# EAGLE design NealEL2MOCOPTOS (EAGLE 7.1.0)
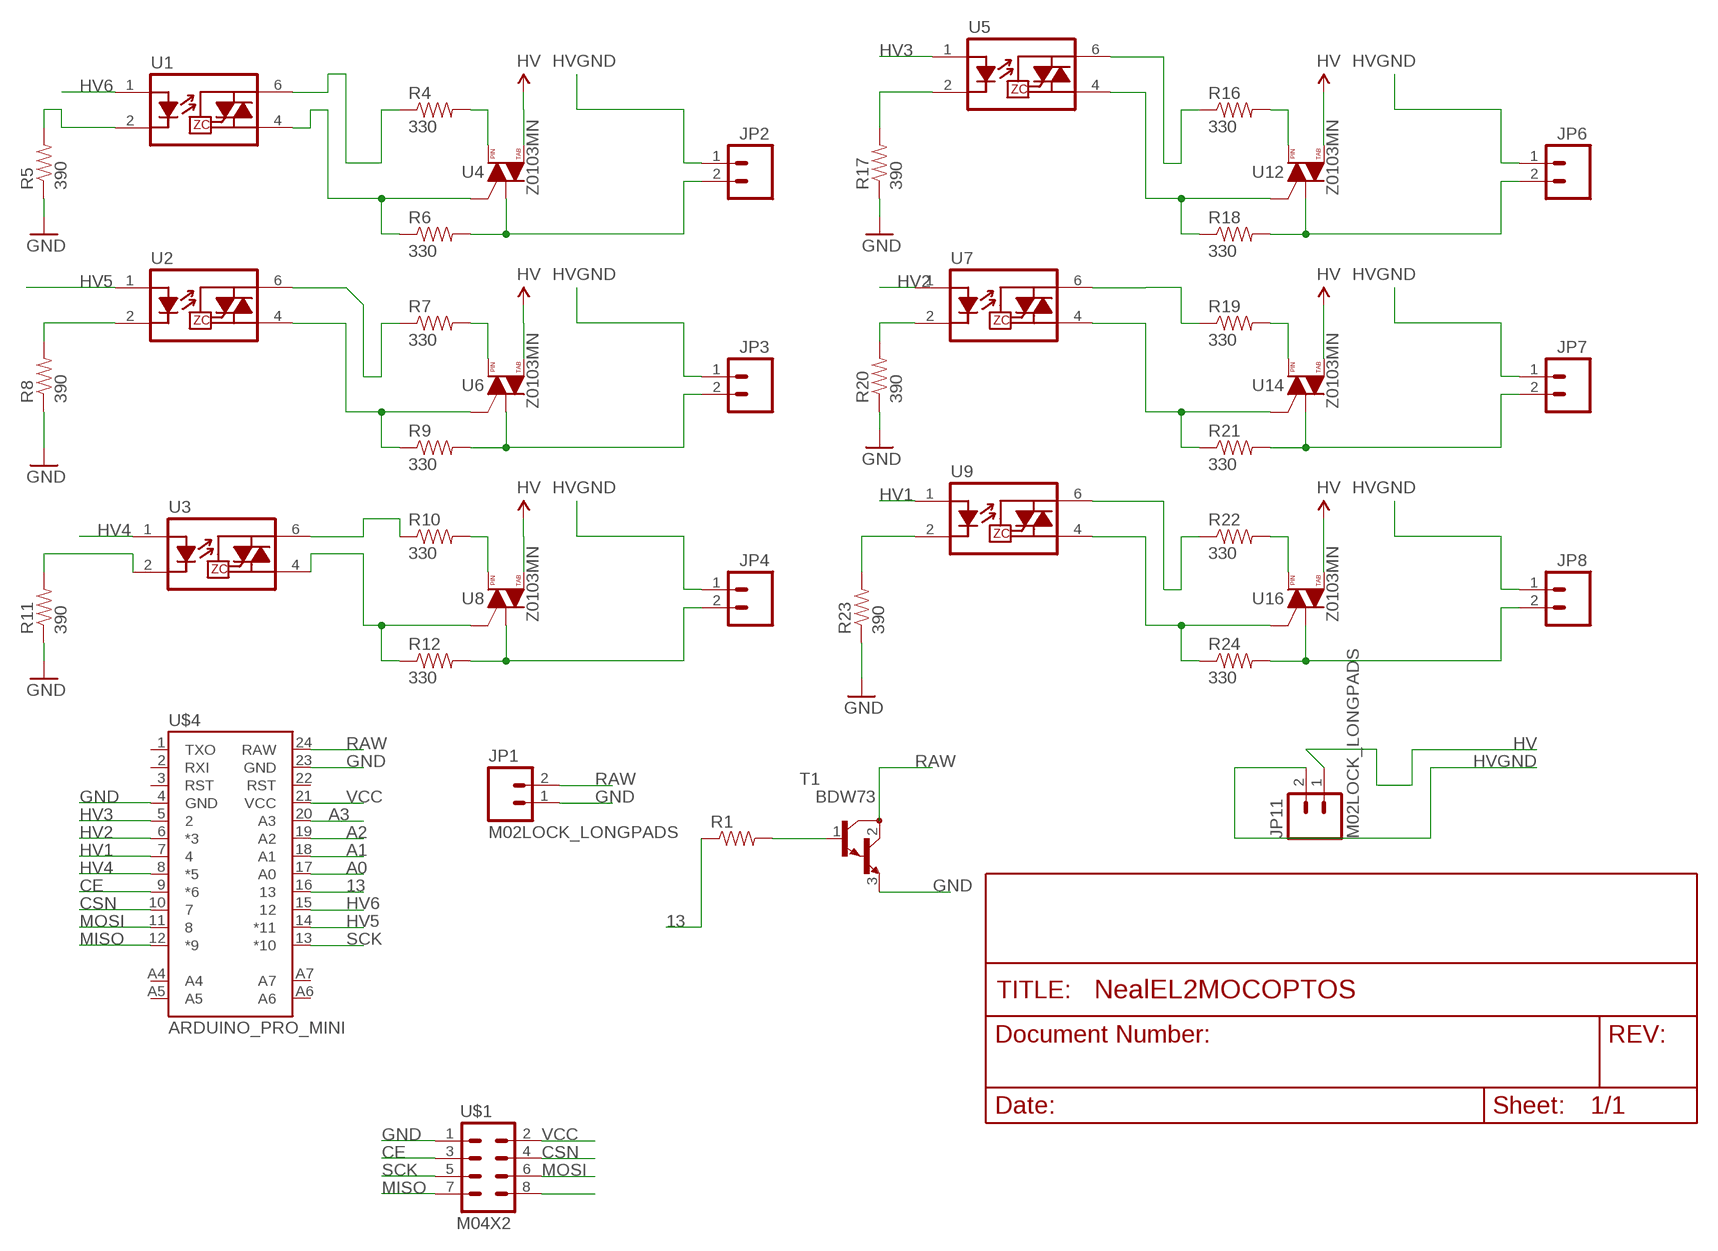
[diagram p0: schematic, sheet 1]

## Parts
JP1  M02LOCK_LONGPADS  [1X02_LOCK_LONGPADS]
JP2  M02PTH  [1X02]
JP3  M02PTH  [1X02]
JP4  M02PTH  [1X02]
JP6  M02PTH  [1X02]
JP7  M02PTH  [1X02]
JP8  M02PTH  [1X02]
JP11  M02LOCK_LONGPADS  [1X02_LOCK_LONGPADS]
R1  RESISTORPTH-1/2W  [AXIAL-0.5]
R4  330  RESISTOR0603-RES  [0603-RES]
R5  390  RESISTOR0603-RES  [0603-RES]
R6  330  RESISTOR0603-RES  [0603-RES]
R7  330  RESISTOR0603-RES  [0603-RES]
R8  390  RESISTOR0603-RES  [0603-RES]
R9  330  RESISTOR0603-RES  [0603-RES]
R10  330  RESISTOR0603-RES  [0603-RES]
R11  390  RESISTOR0603-RES  [0603-RES]
R12  330  RESISTOR0603-RES  [0603-RES]
R16  330  RESISTOR0603-RES  [0603-RES]
R17  390  RESISTOR0603-RES  [0603-RES]
R18  330  RESISTOR0603-RES  [0603-RES]
R19  330  RESISTOR0603-RES  [0603-RES]
R20  390  RESISTOR0603-RES  [0603-RES]
R21  330  RESISTOR0603-RES  [0603-RES]
R22  330  RESISTOR0603-RES  [0603-RES]
R23  390  RESISTOR0603-RES  [0603-RES]
R24  330  RESISTOR0603-RES  [0603-RES]
T1  BDW73  [TO220]
U1  MOC3063S  [DIP8SMD]
U2  MOC3063S  [DIP8SMD]
U3  MOC3063S  [DIP8SMD]
U4  Z0103MN  TRIACSMD  [SOT223]
U5  MOC3063S  [DIP8SMD]
U6  Z0103MN  TRIACSMD  [SOT223]
U7  MOC3063S  [DIP8SMD]
U8  Z0103MN  TRIACSMD  [SOT223]
U9  MOC3063S  [DIP8SMD]
U12  Z0103MN  TRIACSMD  [SOT223]
U14  Z0103MN  TRIACSMD  [SOT223]
U16  Z0103MN  TRIACSMD  [SOT223]
U$1  M04X2  [2X4]
U$4  ARDUINO_PRO_MINI  [ARDUINO_PRO_MINI]

## Nets
13: R1.P$1 U$4.16
A0: U$4.17(A0)
A1: U$4.18(A1)
A2: U$4.19(A2)
A3: U$4.20(A3)
CE: U$1.3 U$4.9(*6)
CSN: U$1.4 U$4.10
GND: JP1.1 R5.1 R8.1 R11.1 R17.1 R20.1 R23.1 T1.3(E) U$1.1 U$4.4(GND) U$4.23(GND)
HV: JP11.1 U4.4(T2) U6.4(T2) U8.4(T2) U12.4(T2) U14.4(T2) U16.4(T2)
HV1: U9.1(A) U$4.7
HV2: U7.1(A) U$4.6(*3)
HV3: U5.1(A) U$4.5
HV4: U3.1(A) U$4.8(*5)
HV5: U2.1(A) U$4.14(*11)
HV6: U1.1(A) U$4.15
HVGND: JP2.1 JP3.1 JP4.1 JP6.1 JP7.1 JP8.1 JP11.2
MISO: U$1.7 U$4.12(*9)
MOSI: U$1.6 U$4.11
N$1: R1.P$2 T1.1(B)
N$5: R6.1 U1.4(T2) U4.3(G)
N$6: R8.2 U2.2(K)
N$7: R4.1 U1.6(T1)
N$8: JP2.2 R6.2 U4.1(T1)
N$9: R10.1 U3.6(T1)
N$10: R9.1 U2.4(T2) U6.3(G)
N$12: R7.1 U2.6(T1)
N$13: JP3.2 R9.2 U6.1(T1)
N$14: R5.2 U1.2(K)
N$15: R4.2 U4.2(T2)
N$16: R12.1 U3.4(T2) U8.3(G)
N$19: JP4.2 R12.2 U8.1(T1)
N$20: R7.2 U6.2(T2)
N$23: R17.2 U5.2(K)
N$24: R20.2 U7.2(K)
N$25: R23.2 U9.2(K)
N$26: R10.2 U8.2(T2)
N$27: R18.1 U5.4(T2) U12.3(G)
N$29: R16.1 U5.6(T1)
N$30: JP6.2 R18.2 U12.1(T1)
N$31: U$1.8
N$32: R21.1 U7.4(T2) U14.3(G)
N$34: R19.1 U7.6(T1)
N$35: JP7.2 R21.2 U14.1(T1)
N$36: R16.2 U12.2(T2)
N$37: R24.1 U9.4(T2) U16.3(G)
N$39: R22.1 U9.6(T1)
N$40: JP8.2 R24.2 U16.1(T1)
N$41: R19.2 U14.2(T2)
N$42: R22.2 U16.2(T2)
N$43: R11.2 U3.2(K)
RAW: JP1.2 T1.2(C) U$4.24(RAW)
SCK: U$1.5 U$4.13(*10)
VCC: U$1.2 U$4.21(VCC)
Unconnected: U$4.1(TXO) U$4.2(RXI) U$4.3(RST) U$4.22(RST) U$4.A4 U$4.A5 U$4.A6 U$4.A7

## Library data of the parts
JP1 JP11 = SparkFun-Connectors:M02: Standard 2-pin 0.1" header. Use with - straight break away headers ( PRT-00116) - right angle break away headers (PRT-00553) - swiss pins (PRT-00743) - machine pins (PRT-00117) - female headers (PRT-00115) Molex polarized connector foot print use with: PRT-08233 with associated crimp pins and housings. 2.54_SCREWTERM for use with PRT-10571. 3.5mm Screw Terminal footprints for PRT-08084 5mm Screw Terminal footprints for use with PRT-08432
JP2-JP4 JP6-JP8 = SparkFun:M02: Header 2 Standard 2-pin 0.1" header. Use with straight break away headers (SKU : PRT-00116), right angle break away headers (PRT-00553), swiss pins (PRT-00743), machine pins (PRT-00117), and female headers (PRT-00115). Molex polarized connector foot print use with SKU : PRT-08233 with associated crimp pins and housings.
R1 = SparkFun-Resistors:RESISTOR: Resistor Basic schematic elements and footprints for 0603, 1206, and PTH resistors.
R4-R12 R16-R24 = SparkFun:RESISTOR: Resistor Basic schematic elements and footprints for 0603, 1206, and PTH resistors.
T1 = transistor:BDW73: NPN BIPOLAR DARLINGTON TRANSISTOR
U1-U3 U5 U7 U9 = SparkFun-DiscreteSemi:MOC3063*: Optotriac in DIP and SMD LED: Vf: 1.2V If: 5 mA TRIAC Vdrm: 600V Itsm: 1A Viso: 5000V DV/dt: 1500V/us DIP: MOC3063 SMD: MOC3063S
U4 U6 U8 U12 U14 U16 = mike-temp:TRIAC
U$1 = SparkFun-Connectors:M04X2: .1" header, two rows of four.
U$4 = SparkFun-Boards:ARDUINO_PRO_MINI

## Net classes
0 Default: width 0.203 mm
1 VCC: width 0.305 mm
2 GND: width 0.813 mm
3 HV: width 0.381 mm

## Board
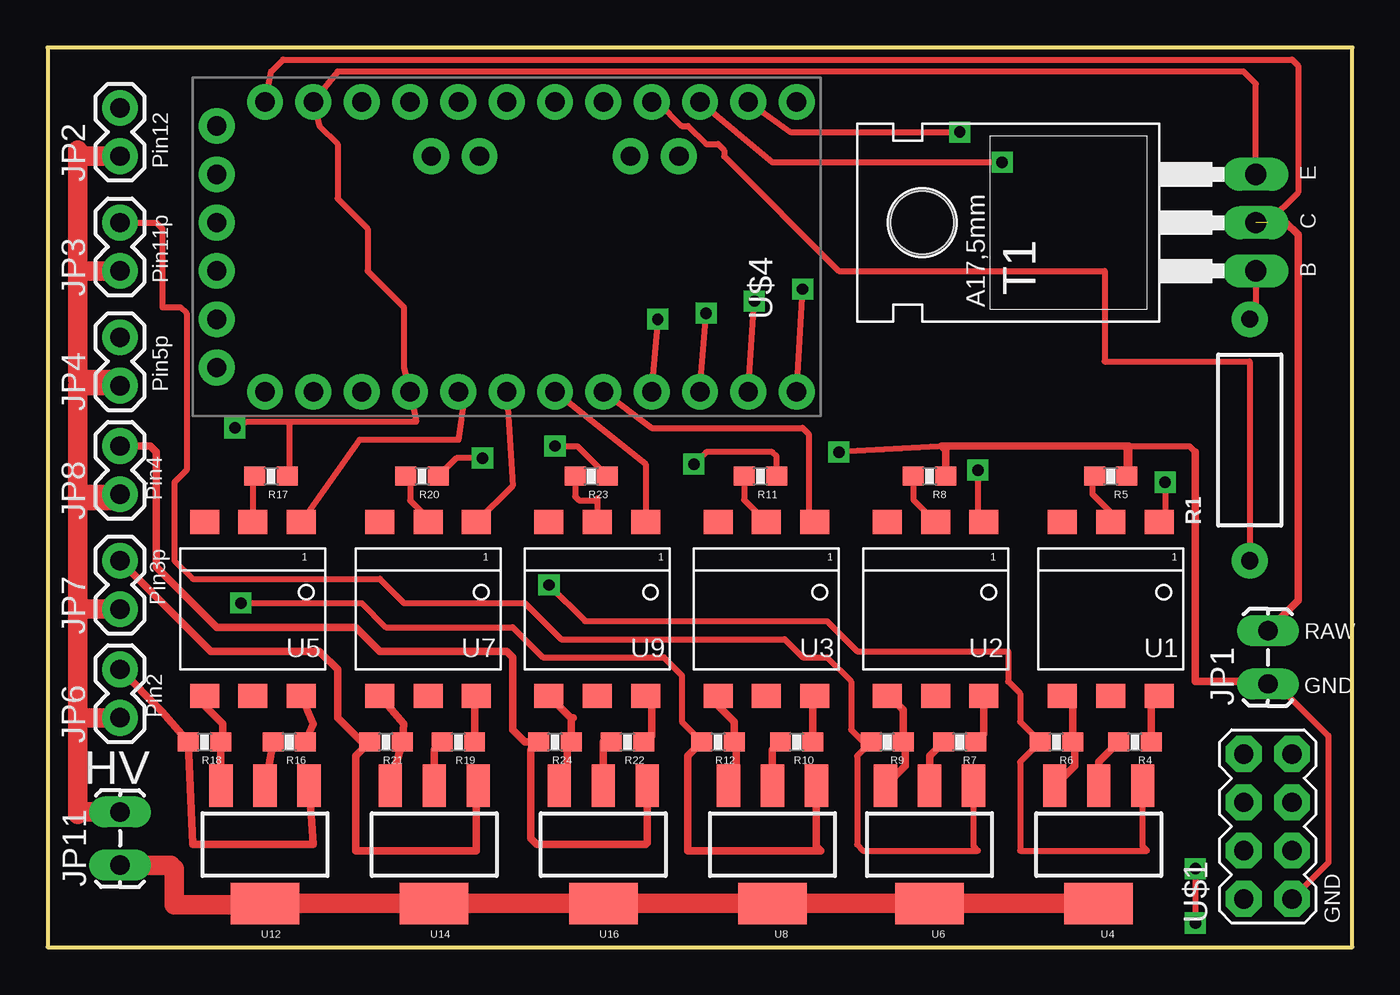
[diagram p1: board, top side]
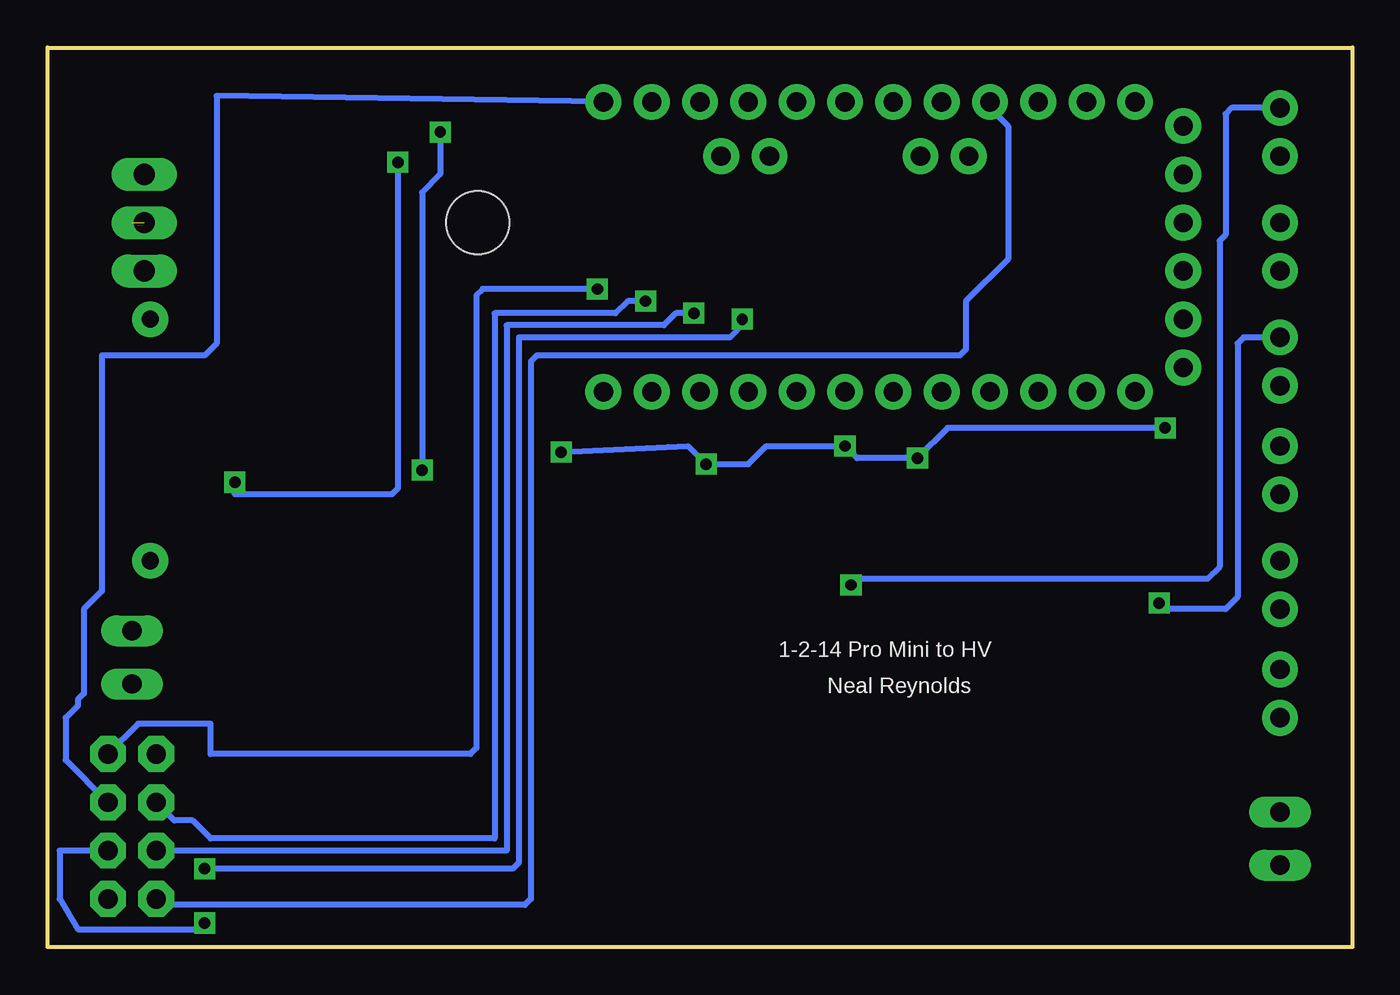
[diagram p2: board, bottom side, seen from below]

Size 68.58 x 47.31 mm. Coordinates in mm from the lower left corner, seen from the top.
Outline: 0,47.31 0,0 68.58,0 68.58,47.31 0,47.31
Copper layers (1*16): Top 0.035mm / dielectric 1.5mm / Bottom 0.035mm
Design rules "SparkFun": minimum track width 8mil, minimum drill 20mil, track to track 8mil, track to pad 8mil, pad to pad 8mil, via to via 8mil, smd to smd 8mil, copper to edge 8mil, drill to drill 8mil, minimum pad ring 12mil, minimum via ring 10mil, stop-mask expansion 4mil, vias tented up to drill 20mil, thermal gap 10mil

### Footprints (pad centres in the part's own frame; a part is rotated, then mirrored left to right if it is on the bottom)
1X02_LOCK_LONGPADS = drill 1.016 long: 1 -0.127,0; 2 2.667,0
1X02 = drill 1.016 pad 1.88: 1 0,0; 2 2.54,0
AXIAL-0.5 = drill 0.9 pad 1.88: P$1 -6.35,0; P$2 6.35,0
0603-RES = smd 1.1 x 1: 1 -0.85,0; 2 0.85,0
TO220 = drill 1.118 long: 1 -2.54,-6.35; 2 0,-6.35; 3 2.54,-6.35 | hole 3.302: 0,11.176
DIP8SMD = smd 1.524 x 1.27: 1 -2.54,-4.572; 2 0,-4.572; 3 2.54,-4.572; 4 2.54,4.572; 5 0,4.572; 6 -2.54,4.572
SOT223 = smd 1.219 x 2.235: 1 -2.311,-3.099; 2 0,-3.099; 3 2.311,-3.099 | smd 3.6 x 2.2: 4 0,3.099
2X4 = drill 1.016 pad 1.88 octagon: 1 -3.81,-1.27; 2 -3.81,1.27; 3 -1.27,-1.27; 4 -1.27,1.27; 5 1.27,-1.27; 6 1.27,1.27; 7 3.81,-1.27; 8 3.81,1.27
ARDUINO_PRO_MINI = drill 1.016 pad 1.88: 1 -7.62,12.7; 2 -7.62,10.16; 3 -7.62,7.62; 4 -7.62,5.08; 5 -7.62,2.54; 6 -7.62,0; 7 -7.62,-2.54; 8 -7.62,-5.08; 9 -7.62,-7.62; 10 -7.62,-10.16; 11 -7.62,-12.7; 12 -7.62,-15.24; 13 7.62,-15.24; 14 7.62,-12.7; 15 7.62,-10.16; 16 7.62,-7.62; 17 7.62,-5.08; 18 7.62,-2.54; 19 7.62,0; 20 7.62,2.54; 21 7.62,5.08; 22 7.62,7.62; 23 7.62,10.16; 24 7.62,12.7; A4 4.763,1.429; A5 4.763,3.969; A6 4.763,-9.049; A7 4.763,-6.509; BLK -6.35,15.24; GND -3.81,15.24; GRN 6.35,15.24; RXI 1.27,15.24; TXO 3.81,15.24; VCC -1.27,15.24

### Placement (x,y rotation side)
JP1  64.13,13.97 90 top
JP2  3.81,41.59 90 top
JP3  3.81,35.56 90 top
JP4  3.81,29.53 90 top
JP6  3.81,12.06 90 top
JP7  3.81,17.78 90 top
JP8  3.81,23.81 90 top
JP11  3.81,4.45 90 top
R1  63.18,26.67 90 top
R4  57.15,10.79 180 top
R5  55.88,24.77 180 top
R6  53.02,10.79 180 top
R7  47.94,10.79 180 top
R8  46.36,24.77 180 top
R9  44.13,10.79 180 top
R10  39.37,10.79 180 top
R11  37.47,24.77 180 top
R12  35.24,10.79 180 top
R16  12.7,10.79 180 top
R17  11.75,24.77 180 top
R18  8.26,10.79 180 top
R19  21.59,10.79 180 top
R20  19.68,24.77 180 top
R21  17.78,10.79 180 top
R22  30.48,10.79 180 top
R23  28.57,24.77 180 top
R24  26.67,10.79 180 top
T1  57.15,38.1 90 top
U1  55.88,17.78 180 top
U2  46.67,17.78 180 top
U3  37.78,17.78 180 top
U4  55.25,5.4 180 top
U5  10.79,17.78 180 top
U6  46.36,5.4 180 top
U7  20,17.78 180 top
U8  38.1,5.4 180 top
U9  28.89,17.78 180 top
U12  11.43,5.4 180 top
U14  20.32,5.4 180 top
U16  29.21,5.4 180 top
U$1  64.13,6.35 90 top
U$4  24.13,36.83 90 top

### Tracks (layer width: path | path; a pad name or v marks a point on that pad's centre or on a via)
13
  Top 0.305: R1.P$1 63.18,30.8 55.56,30.8 55.56,35.56 41.59,35.56 35.56,41.59 35.56,41.91 35.24,42.23 34.61,42.23 33.66,43.18 33.34,43.18 32.07,44.45 U$4.16
CE  (via drill 0.6)
  Top 0.305: U$4.9 32.07,32.7 v32.07,33.02 | v60.33,4.13 v60.33,1.27
  Bottom 0.305: v32.07,33.02 32.07,32.7 32.7,32.07 43.82,32.07 43.82,4.45 44.13,4.13 v60.33,4.13 | U$1.3 67.94,5.08 67.94,2.54 66.99,0.95 60.64,0.95 v60.33,1.27
CSN  (via drill 0.6)
  Top 0.305: U$4.10 v34.61,33.34
  Bottom 0.305: v34.61,33.34 35.56,33.34 36.2,32.7 44.45,32.7 44.45,5.08 U$1.4
GND  (via drill 0.6)
  Top 0.305: 12.7,27.62 19.37,27.62 U$4.4 18.73,30.48 18.73,33.65 16.83,35.56 16.83,37.78 15.24,39.37 15.24,42.23 14.29,43.18 U$4.23 15.24,46.04 62.87,46.04 63.5,45.4 T1.3 | 12.7,27.62 12.7,24.87 R17.1 | 12.7,27.62 10.48,27.62 v9.84,27.3 | v22.86,25.72 21.49,25.72 R20.1 | v26.67,26.35 27.84,26.35 R23.1 | R11.1 38.32,25.82 38.1,26.03 34.61,26.03 v33.97,25.4 | R8.1 47.21,26.25 47.31,26.35 v41.59,26.03 | JP1.1 64.58,13.84 67.31,11.11 67.31,4.45 U$1.1 | R5.1 56.73,26.25 56.83,26.35 60.01,26.35 60.33,26.03
  Top 0.406: 60.33,26.03 60.33,13.97 64.01,13.97 JP1.1 | R8.1 47.21,26.14 46.99,26.35 56.83,26.35 56.83,24.87 R5.1
  Bottom 0.305: v9.84,27.3 21.27,27.3 v22.86,25.72 26.04,25.72 v26.67,26.35 30.8,26.35 31.75,25.4 v33.97,25.4 34.93,26.35 v41.59,26.03
HV
  Top 1.016: JP11.1 6.48,4.32 6.67,4.13 6.67,2.22 11.35,2.22 U12.4 U14.4 U16.4 U8.4 | U8.4 38.66,2.3 38.73,2.22 38.18,2.22 U8.4 | U8.4 U6.4 U4.4
  Top 1.27: 11,2.73 U12.4
HV1
  Top 0.305: U$4.7 31.43,25.4 U9.1
HV2
  Top 0.305: U$4.6 24.45,24.26 U7.1
HV3
  Top 0.305: U$4.5 21.91,28.89 21.59,26.67 16.38,26.67 U5.1
HV4
  Top 0.305: U$4.8 31.75,27.3 39.69,27.3 40.01,26.99 40.01,22.67 U3.1
HV5  (via drill 0.6)
  Top 0.305: U$4.14 39.05,42.86 v47.94,42.86 | v48.9,25.08 48.9,22.67 U2.1
  Bottom 0.305: v47.94,42.86 47.94,40.64 48.9,39.69 v48.9,25.08
HV6  (via drill 0.6)
  Top 0.305: U$4.15 38.1,41.28 v50.16,41.28 | v58.74,24.45 58.74,22.67 U1.1
  Bottom 0.305: v50.16,41.28 50.16,24.13 50.48,23.81 58.74,23.81 v58.74,24.45
HVGND
  Top 1.016: JP11.2 1.71,7.11 1.59,6.99 1.59,12.07 | JP6.1 1.59,12.07 | 1.59,12.07 1.59,17.78 | JP7.1 1.59,17.78 | 1.59,17.78 1.59,23.49 | 1.59,23.49 1.59,23.81 | 1.59,23.81 JP8.1 3.49,23.49 1.59,23.49 | 1.59,23.81 1.59,29.53 JP4.1 3.49,29.85 1.59,29.85 1.59,35.56 | JP3.1 1.59,35.56 | 1.59,35.56 1.59,41.91 1.91,41.59 JP2.1
MISO  (via drill 0.6)
  Top 0.305: U$4.12 v39.69,34.61
  Bottom 0.305: v39.69,34.61 45.72,34.61 46.04,34.29 46.04,10.48 46.36,10.16 60.01,10.16 60.01,11.75 63.82,11.75 U$1.7
MOSI  (via drill 0.6)
  Top 0.305: U$4.11 v37.15,33.97
  Bottom 0.305: v37.15,33.97 38.1,33.97 38.73,33.34 45.09,33.34 45.09,5.71 60.01,5.71 60.96,6.67 61.91,6.67 U$1.6
N$1
  Top 0.305: T1.1 63.5,33.34 R1.P$2
N$5
  Top 0.406: U1.4 53.87,12.68 R6.1 53.98,10.69 53.98,9.52 52.95,8.5 U4.3
N$6
  Top 0.305: R8.2 45.51,23.52 U2.2
N$7
  Top 0.406: U1.6 58,12.79 R4.1
N$8  (via drill 0.6)
  Top 0.305: U4.1 57.56,5.31 57.79,5.08 51.12,5.08 51.12,9.74 R6.2 51.12,11.85 51.12,13.33 50.48,13.97 50.48,15.56 42.55,15.56 40.96,17.14 28.26,17.14 v26.35,19.05
  Top 0.406: U4.1 57.79,8.57
  Bottom 0.305: JP2.2 6.35,44.13 6.67,43.82 6.67,37.46 6.99,37.15 6.99,20 7.62,19.37 26.04,19.37 v26.35,19.05
N$9
  Top 0.406: U3.6 40.22,13.11 R10.1
N$10
  Top 0.406: U6.3 44.06,8.5 45.09,9.52 45.09,10.69 R9.1 44.98,12.49 44.45,13.02 44.32,13.02 U2.4
N$12
  Top 0.406: R7.1 49.21,11.22 U2.6
N$13
  Top 0.305: JP3.2 5.71,38.1 6.03,37.78 6.03,33.65 6.99,33.65 7.3,33.34 7.3,25.08 6.67,24.45 6.67,20.32 7.62,19.37 17.46,19.37 18.73,18.1 25.08,18.1 26.99,16.19 38.73,16.19 39.69,15.24 40.96,15.24 42.23,13.97 42.23,11.43 42.86,10.8 R9.2 42.55,10.06 42.55,5.4 42.86,5.08 48.9,5.08 48.67,5.31 U6.1
N$14
  Top 0.305: U1.2 55.88,22.86 54.93,23.81 54.93,24.66 R5.2
N$15
  Top 0.406: R4.2 55.25,9.74 U4.2
N$16
  Top 0.406: U8.3 35.79,8.8 36.2,9.21 36.2,10.69 R12.1 36.09,11.85 35.24,12.7 U3.4
N$19  (via drill 0.6)
  Top 0.305: v10.16,18.1 16.51,18.1 17.78,16.83 24.45,16.83 26.04,15.24 32.39,15.24 33.34,14.29 33.34,11.85 R12.2
  Top 0.406: U8.1 40.41,5.31 40.64,5.08 33.66,5.08 33.66,10.06 R12.2
  Bottom 0.305: JP4.2 5.71,32.07 6.03,31.75 6.03,18.42 6.67,17.78 9.84,17.78 v10.16,18.1
N$20
  Top 0.406: R7.2 46.36,10.06 U6.2
N$23
  Top 0.305: R17.2 10.79,24.66 U5.2
N$24
  Top 0.305: R20.2 19.05,24.55 19.05,23.49 20,22.54 U7.2
N$25
  Top 0.305: 28.89,23.6 28.89,23.49 | 28.89,23.49 U9.2 | R23.2 27.72,23.71 27.94,23.49 28.89,23.49
N$26
  Top 0.406: R10.2 38.1,10.38 U8.2
N$27
  Top 0.406: U12.3 9.11,8.51 R18.1 9.21,10.9 9.21,11.75 8.26,12.7 U5.4
N$29
  Top 0.406: U5.6 13.97,11.75 R16.1
N$30
  Top 0.406: JP6.2 6.03,12.38 R18.2 7.62,5.4 13.97,5.4 U12.1
N$32
  Top 0.406: U7.4 18.73,11.75 R21.1 U14.3
N$34
  Top 0.406: U7.6 22.44,13.11 R19.1
N$35
  Top 0.406: R21.2 16.56,10.43 | 16.56,10.43 16.19,10.06 16.19,5.08 22.54,5.08 22.54,7.94 22.63,8.03 U14.1 | JP7.2 8.57,15.56 14.29,15.56 15.24,14.6 15.24,12.07 16.56,10.74 16.56,10.43
N$36
  Top 0.406: R16.2 U12.2
N$37
  Top 0.406: U16.3 27.06,8.5 27.3,8.25 27.3,10.58 R24.1 27.52,11.96 27.62,12.07 27.5,12.07 U9.4
N$39
  Top 0.406: U9.6 31.75,12.89 31.75,11.11 31.43,10.8 R22.1
N$40
  Top 0.406: JP8.2 5.4,26.35 5.71,26.03 5.71,20 8.89,16.83 16.19,16.83 17.46,15.56 24.13,15.56 24.45,15.24 24.45,11.43 25.08,10.8 R24.2 25.4,10.38 25.4,5.71 25.72,5.4 31.43,5.4 31.52,5.49 U16.1
N$41
  Top 0.406: R19.2 20.32,10.38 U14.2
N$42
  Top 0.406: U16.2 29.21,10.8 R22.2
N$43
  Top 0.305: R11.2 36.62,23.52 U3.2
RAW  (1 unrouted)
  Top 0.305: U$4.24 11.75,46.04 12.38,46.67 65.41,46.67 65.72,46.35 65.72,39.69 64.13,38.1 64.13,37.78
  Top 0.406: T1.2 65.09,38.1 65.72,37.46 65.72,18.22 JP1.2
SCK
  Bottom 0.305: U$4.13 59.69,44.77 59.69,31.75 60.33,31.12 65.72,31.12 65.72,18.73 66.67,17.78 66.67,13.33 66.99,13.02 66.99,12.7 67.63,12.07 67.63,9.84 U$1.5
VCC
  Bottom 0.305: U$4.21 19.37,44.45 18.1,43.18 18.1,36.2 20.32,33.97 20.32,31.43 20.64,31.12 42.86,31.12 43.18,30.8 43.18,2.54 43.5,2.22 62.55,2.22 U$1.2

### Text on the board
tPlace: Pin12 | E | C | B | Pin11p | Pin5p | Pin4 | Pin3p | 1 | 1 | 1 | 1 | 1 | 1 | RAW | GND | Pin2 | HV | GND
bPlace: 1-2-14 Pro Mini to HV | Neal Reynolds
tValues: R Owens, M Grusin